# EAGLE design DemoSensorAddon (EAGLE 7.7.0)
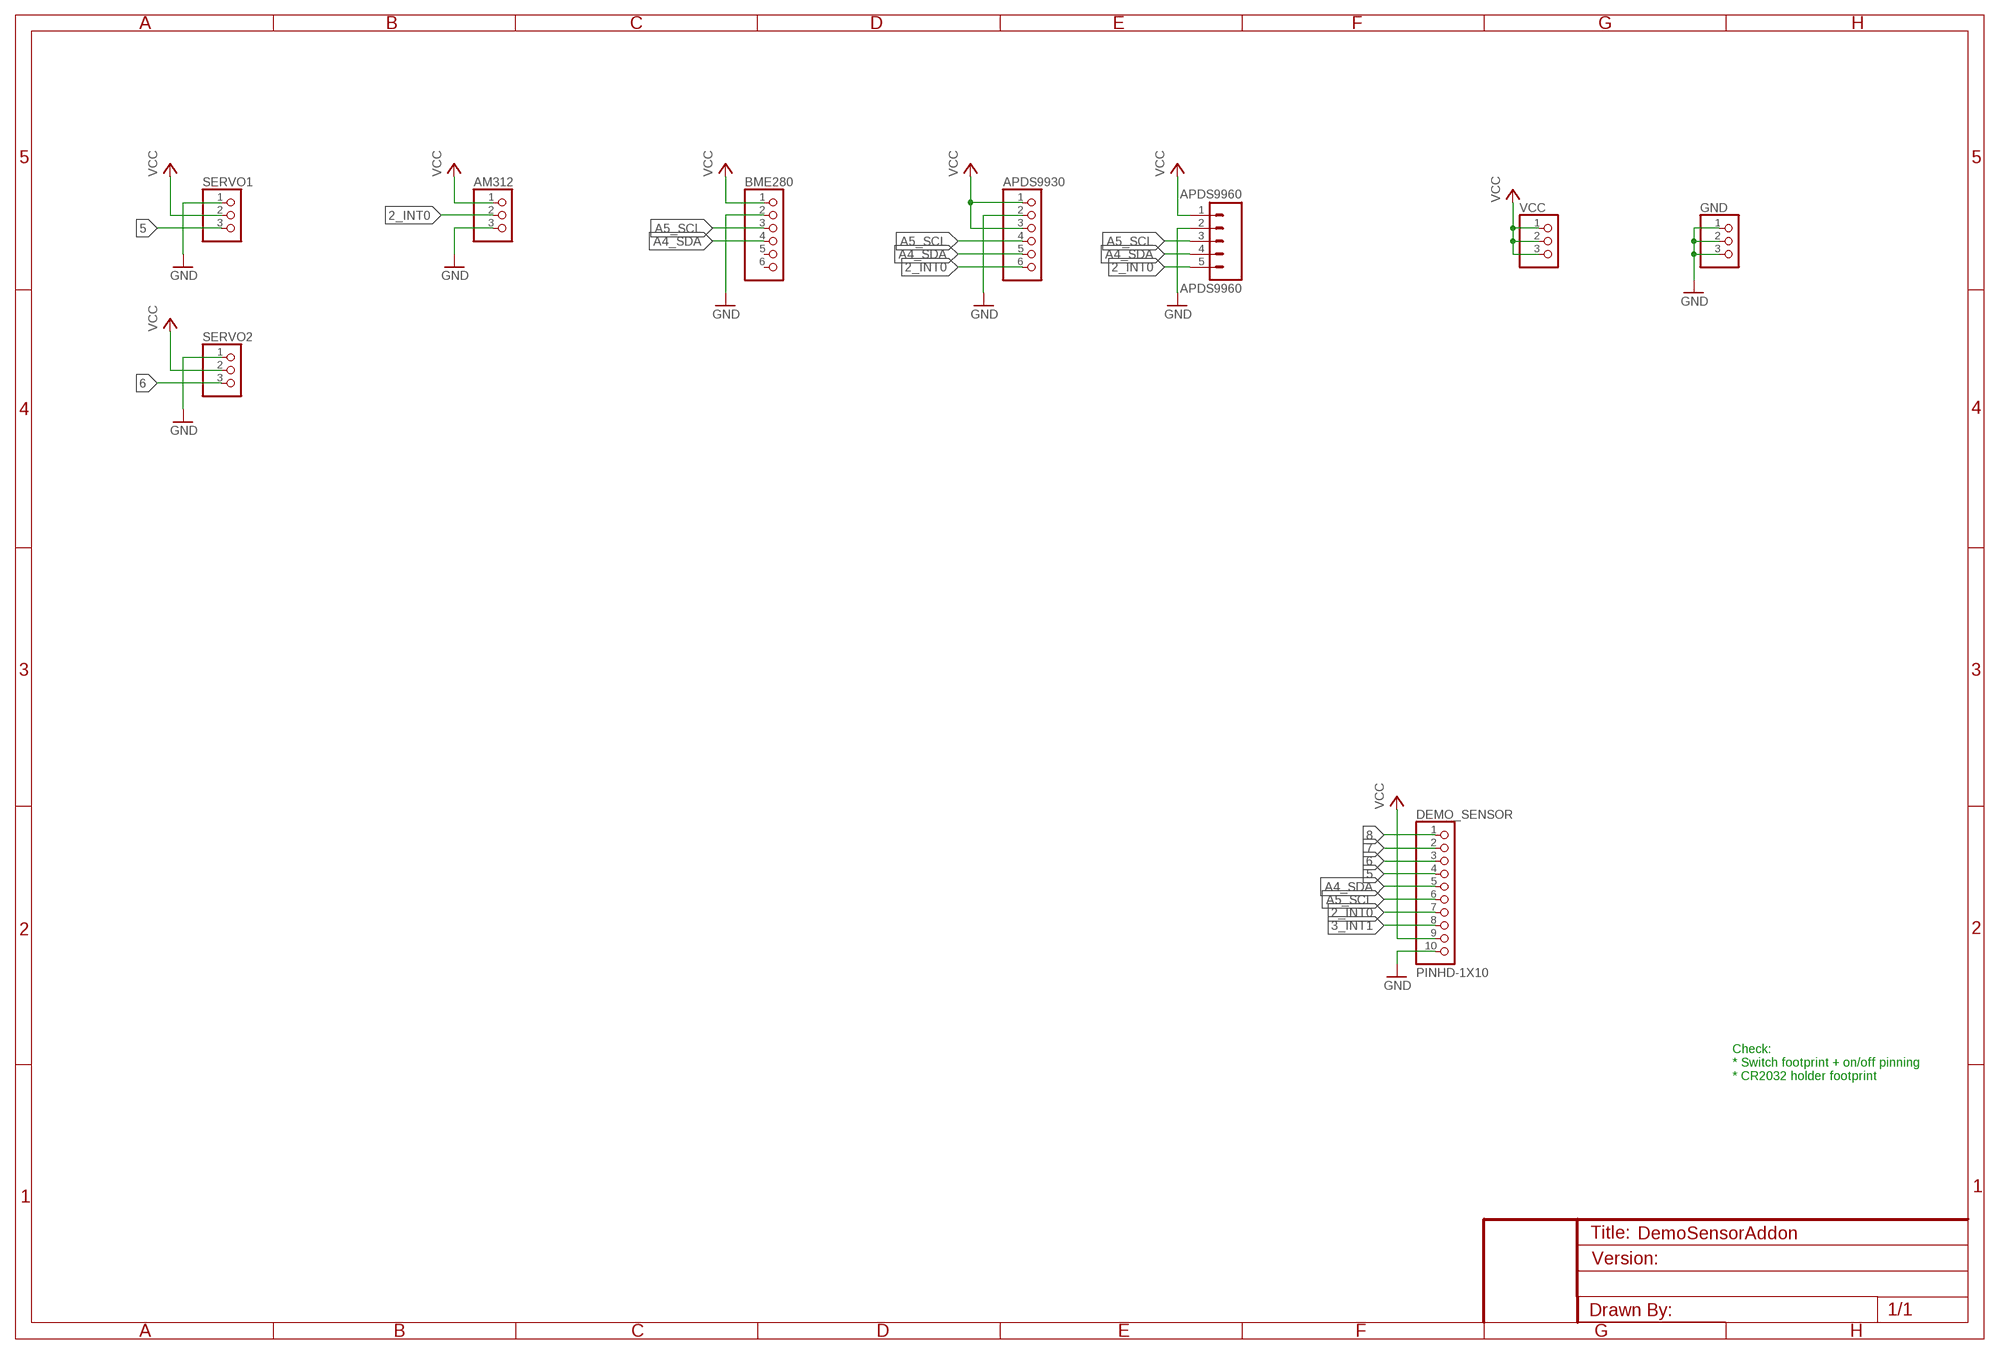
[diagram p0: schematic, sheet 1]

## Parts
AM312  PINHD-1X3  [1X03]
APDS9930  PINHD-1X6  [1X06]
APDS9960  APDS9960  M05PTH  [1X05]
BME280  PINHD-1X6  [1X06]
DEMO_SENSOR  PINHD-1X10  [1X10-BIG]
GND  PINHD-1X3  [1X03]
SERVO1  PINHD-1X3  [1X03]
SERVO2  PINHD-1X3  [1X03]
VCC  PINHD-1X3  [1X03]

## Nets
2_INT0: AM312.2 APDS9930.6 APDS9960.5 DEMO_SENSOR.7
3_INT1: DEMO_SENSOR.8
5: DEMO_SENSOR.4 SERVO1.3
6: DEMO_SENSOR.3 SERVO2.3
7: DEMO_SENSOR.2
8: DEMO_SENSOR.1
A4_SDA: APDS9930.5 APDS9960.4 BME280.4 DEMO_SENSOR.5
A5_SCL: APDS9930.4 APDS9960.3 BME280.3 DEMO_SENSOR.6
GND: AM312.3 APDS9930.2 APDS9960.2 BME280.2 DEMO_SENSOR.10 GND.1 GND.2 GND.3 SERVO1.1 SERVO2.1
VCC: AM312.1 APDS9930.1 APDS9930.3 APDS9960.1 BME280.1 DEMO_SENSOR.9 SERVO1.2 SERVO2.2 VCC.1 VCC.2 VCC.3
Unconnected: BME280.5 BME280.6

## Notes on the sheet
- Check:
  * Switch footprint + on/off pinning
  * CR2032 holder footprint

## Library data of the parts
AM312 GND SERVO1 SERVO2 VCC = adafruit:PINHD-1X3: PIN HEADER
APDS9930 BME280 = adafruit:PINHD-1X6: PIN HEADER
APDS9960 = SparkFun:M05: Header 5 Standard 5-pin 0.1" header. Use with straight break away headers (SKU : PRT-00116), right angle break away headers (PRT-00553), swiss pins (PRT-00743), machine pins (PRT-00117), and female headers (PRT-00115). Molex polarized connector foot print use with SKU : PRT-08230 with associated crimp pins and housings.
DEMO_SENSOR = adafruit:PINHD-1X10: Pin header 1x10 0.1" spacing With round pins

## Board
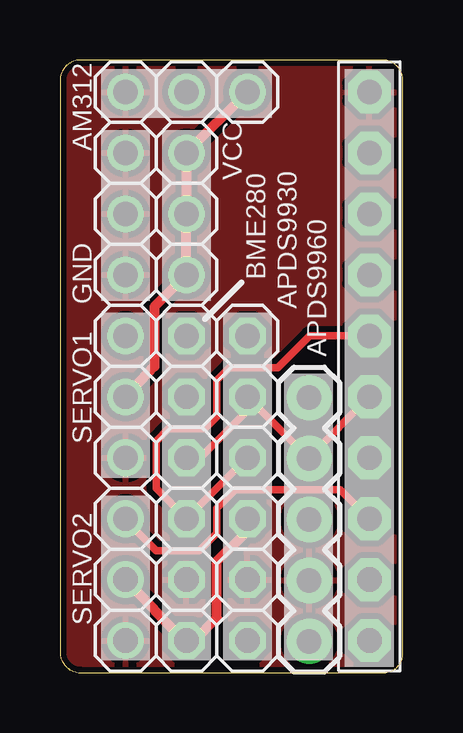
[diagram p1: board, top side]
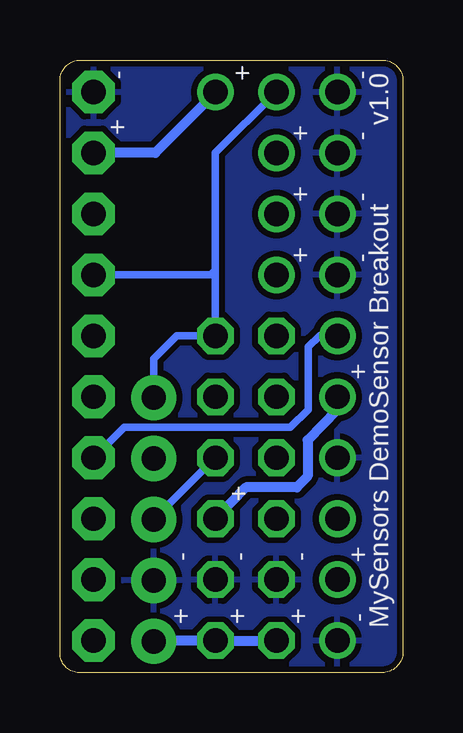
[diagram p2: board, bottom side, seen from below]

Size 14.29 x 25.53 mm. Coordinates in mm from the lower left corner, seen from the top.
Outline: 13.44,25.53 0.86,25.53 arc90 0,24.66 0,0.86 arc90 0.86,0 13.48,0 arc90 14.29,0.8 14.29,24.68 arc90 13.44,25.53
Copper layers (1*16): Top 0.035mm / dielectric 1.5mm / Bottom 0.035mm
Design rules "dirt_cheap_dirty_boards.v1": minimum track width 5mil, minimum drill 12mil, track to track 5mil, track to pad 5mil, pad to pad 5mil, via to via 5mil, smd to smd 0mil, copper to edge 10mil, drill to drill 10mil, minimum pad ring 10mil, minimum via ring 6mil, stop-mask expansion 2mil, vias tented up to drill 25mil, thermal gap 10mil

### Footprints (pad centres in the part's own frame; a part is rotated, then mirrored left to right if it is on the bottom)
1X03 = drill 1.016: 1 -2.54,0; 2 0,0; 3 2.54,0
1X06 = drill 1.016 octagon: 1 -6.35,0; 2 -3.81,0; 3 -1.27,0; 4 1.27,0; 5 3.81,0; 6 6.35,0
1X05 = drill 1.016 pad 1.88: 1 0,0; 2 2.54,0; 3 5.08,0; 4 7.62,0; 5 10.16,0
1X10-BIG = drill 1.016 pad 1.778 octagon: 1 -11.43,0; 2 -8.89,0; 3 -6.35,0; 4 -3.81,0; 5 -1.27,0; 6 1.27,0; 7 3.81,0; 8 6.35,0; 9 8.89,0; 10 11.43,0

### Placement (x,y rotation side)
AM312  5.27,24.19 180 top
APDS9930  7.81,7.68 90 top
APDS9960  10.38,1.3 90 top
BME280  5.27,7.68 90 top
DEMO_SENSOR  12.89,12.76 90 top
GND  2.73,19.11 90 top
SERVO1  2.73,11.49 90 top
SERVO2  2.73,3.87 90 top
VCC  5.27,19.11 90 top

### Tracks (layer width: path | path; a pad name or v marks a point on that pad's centre or on a via)
2_INT0
  Bottom 0.305: 7.81,16.76 APDS9930.6 9.43,14.03 10.38,13.08 APDS9960.5 | 7.81,16.76 7.81,21.65 AM312.2 | DEMO_SENSOR.7 8,16.57 7.81,16.76
5
  Bottom 0.305: SERVO1.3 3.46,14.03 3.94,13.59 3.94,10.95 4.7,10.22 11.62,10.22 DEMO_SENSOR.4
6
  Top 0.305: 2.73,6.35 4,5.08 5.81,5.08 6.54,5.81 6.54,6.86 7.3,7.62 11.68,7.62 DEMO_SENSOR.3
  Top 0.406: SERVO2.3 2.73,6.35
A4_SDA
  Top 0.305: DEMO_SENSOR.5 10.38,8.98 APDS9960.4 APDS9930.5 7.81,10.92 5.84,8.95 BME280.4
A5_SCL
  Top 0.305: DEMO_SENSOR.6 10.41,14.03 9.08,12.7 7.05,12.7 6.54,12.19 6.54,10.67 6.03,10.16 4.51,10.16 4,9.65 4,7.68 BME280.3 APDS9930.4
  Bottom 0.305: APDS9960.3 APDS9930.4
GND
  pour Bottom (isolate 0.254): -12,25.91 14.67,25.78 14.67,-0.51 -12,-0.51
  pour Top (isolate 0.254): -11.87,26.04 14.67,26.04 14.67,-0.38 -11.87,-0.38
VCC
  Top 0.406: APDS9930.3 7.84,6.41 7.84,5.94 6.54,4.64 6.54,2.29 5.59,1.33 BME280.1 5.14,1.33 SERVO2.2 | SERVO1.2 3.94,12.76 3.94,15.24 VCC.1 VCC.2 VCC.3 AM312.1
  Bottom 0.406: SERVO1.2 2.73,10.95 3.97,9.68 3.97,8.19 4.41,7.71 6.54,7.71 APDS9930.3 | BME280.1 APDS9930.1 10.35,1.33 APDS9960.1 | AM312.1 7.81,24.16 10.32,21.65 DEMO_SENSOR.9

### Text on the board
bNames: - | + | - | v1.0 | - | + | + | - | + | - | + | + | MySensors DemoSensor Breakout | + | + | - | - | - | - | + | + | +